# Altium schematic sheet Led_chaser2.SchDoc
size A4; SheetNumber: 1; SheetTotal: 1
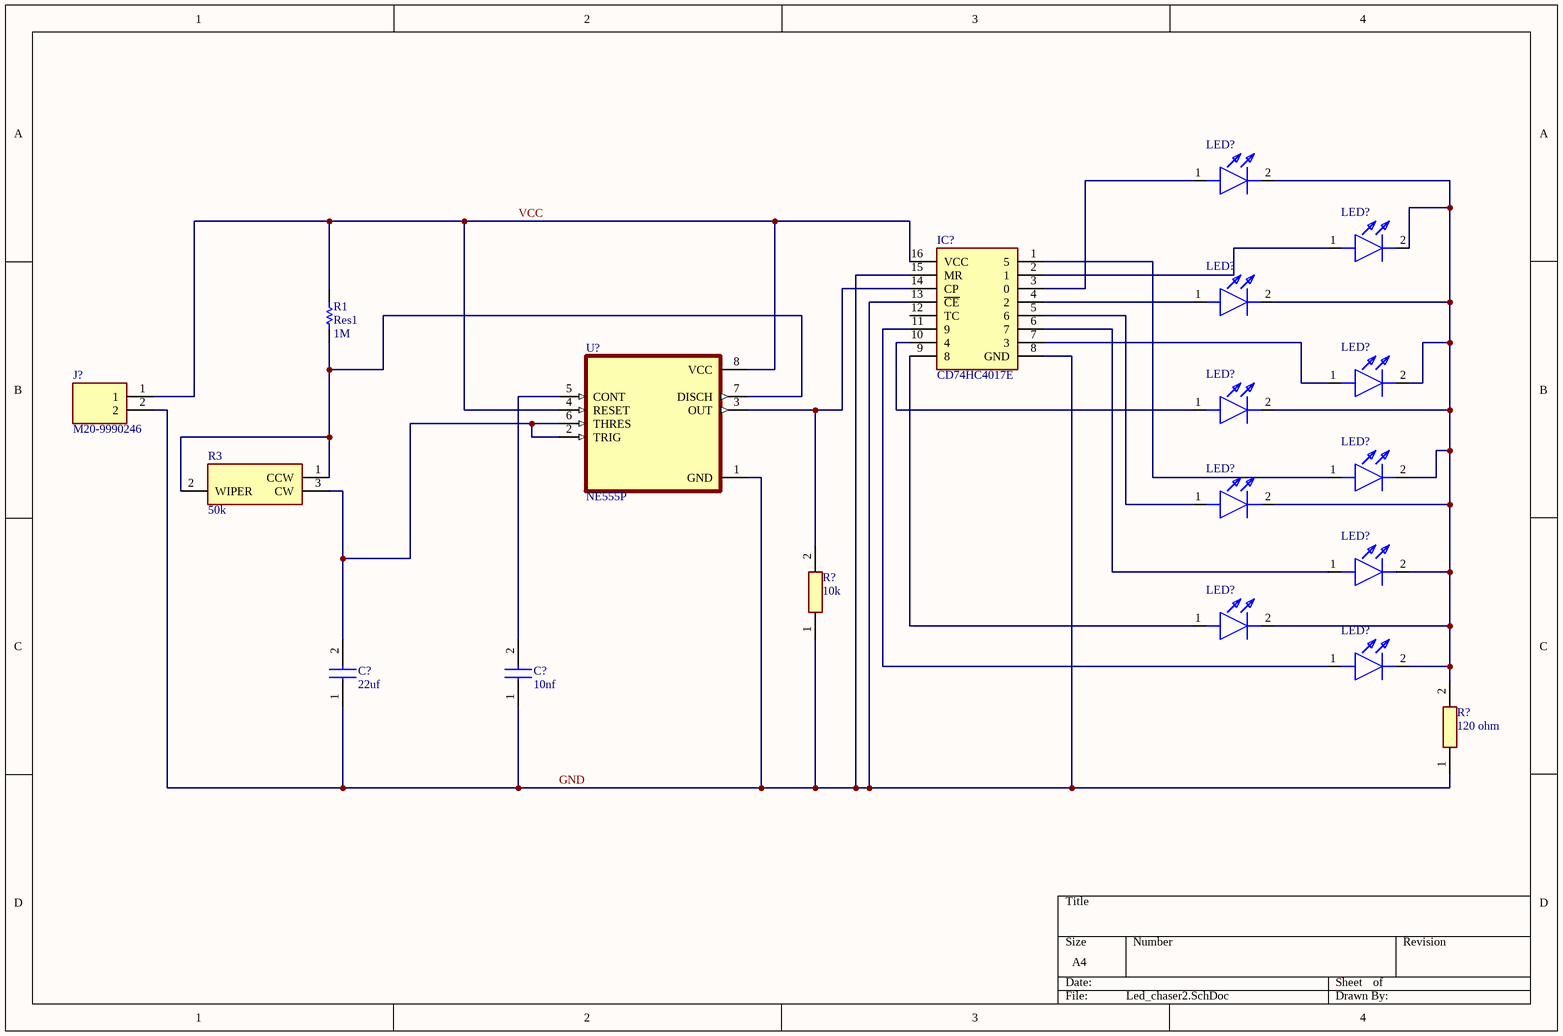
[diagram p0: Led_chaser2.SchDoc]

## Parts
(Parts that share a designator on the sheet are numbered #1, #2 ... from top to bottom, then left to right.)
C?#1  22uf  [RCEC71H226MWK1H03B]
C?#2  10nf  [RCEC71H226MWK1H03B]
IC?  CD74HC4017E  [DIP794W53P254L1930H508Q16N]
J?  M20-9990246  [HDRV2W66P0X254_1X2_508X254X874P]
LED?#1  151051BS04000  [151051BS04000]  (value not drawn)
LED?#2  151051BS04000  [151051BS04000]  (value not drawn)
LED?#3  151051BS04000  [151051BS04000]  (value not drawn)
LED?#4  151051BS04000  [151051BS04000]  (value not drawn)
LED?#5  151051BS04000  [151051BS04000]  (value not drawn)
LED?#6  151051BS04000  [151051BS04000]  (value not drawn)
LED?#7  151051BS04000  [151051BS04000]  (value not drawn)
LED?#8  151051BS04000  [151051BS04000]  (value not drawn)
LED?#9  151051BS04000  [151051BS04000]  (value not drawn)
LED?#10  151051BS04000  [151051BS04000]  (value not drawn)
R1  Res1  value 1M  [AXIAL-0.3]
R3  50k  [3386P_1]
R?#1  10k  [RESAD1700W60L700D250]
R?#2  120 ohm  [RESAD1700W60L700D250]
U?  NE555P  [DIP794W45P254L959H508Q8]

## Nets
GND: C?#1.1 C?#2.1 IC?.8(GND) IC?.13(~{CE}) IC?.15(MR) J?.2 R?#1.1 R?#2.1 U?.1(GND)
VCC: IC?.16(VCC) J?.1 R1.2 U?.4(RESET) U?.8(VCC)
NetC?#1_2: C?#1.2 R3.3(CW) U?.2(TRIG) U?.6(THRES)
NetC?#2_2: C?#2.2 U?.5(CONT)
NetIC?_1: IC?.1(5) LED?#6.1(A)
NetIC?_2: IC?.2(1) LED?#2.1(A)
NetIC?_3: IC?.3(0) LED?#1.1(A)
NetIC?_4: IC?.4(2) LED?#3.1(A)
NetIC?_5: IC?.5(6) LED?#7.1(A)
NetIC?_6: IC?.6(7) LED?#8.1(A)
NetIC?_7: IC?.7(3) LED?#4.1(A)
NetIC?_9: IC?.9(8) LED?#9.1(A)
NetIC?_10: IC?.10(4) LED?#5.1(A)
NetIC?_11: IC?.11(9) LED?#10.1(A)
NetIC?_14: IC?.14(CP) R?#1.2 U?.3(OUT)
NetLED?#1_2: LED?#1.2(K) LED?#2.2(K) LED?#3.2(K) LED?#4.2(K) LED?#5.2(K) LED?#6.2(K) LED?#7.2(K) LED?#8.2(K) LED?#9.2(K) LED?#10.2(K) R?#2.2
NetR1_1: R1.1 R3.1(CCW) R3.2(WIPER) U?.7(DISCH)

Not connected (* = marked no-connect by the designer): IC? 12(TC)

## Library data of the parts
C?#1 C?#2 = RCER71E226MWM1H03A: Capacitor; Manufacturer_Name: Murata Electronics; Datasheet Link: https://psearch.en.murata.com/capacitor/product/RCER71E226MWM1H03A.html; Height: 10mm; Manufacturer_Part_Number: RCER71E226MWM1H03A; Mouser Part Number: 81-RCER71E226MWM1H3A; Mouser Price/Stock: https://www.mouser.co.uk/ProductDetail/Murata-Electronics/RCER71E226MWM1H03A/?qs=Zt%252BKPUOg4ofMKWtzCSsNGA%3D%3D
IC? = CD74HC4017E: Integrated Circuit; Manufacturer_Name: Texas Instruments; Datasheet Link: http://www.ti.com/lit/gpn/cd74hc4017; Height: 5.08mm; Manufacturer_Part_Number: CD74HC4017E; Mouser Part Number: 595-CD74HC4017E; Mouser Price/Stock: https://www.mouser.co.uk/ProductDetail/Texas-Instruments/CD74HC4017E?qs=spW5eSrOWB5vviXLi8qByQ%3D%3D; Arrow Part Number: CD74HC4017E; Arrow Price/Stock: https://www.arrow.com/en/products/cd74hc4017e/texas-instruments?region=nac
J? = M20-9990246: Connector; Manufacturer_Name: Harwin; Datasheet Link: https://cdn.harwin.com/pdfs/M20-999.pdf; Height: 8.74mm; Manufacturer_Part_Number: M20-9990246; Mouser Part Number: 855-M20-9990246; Mouser Price/Stock: https://www.mouser.co.uk/ProductDetail/Harwin/M20-9990246?qs=Jph8NoUxIfWjw4WmyRvzag%3D%3D
LED?#1-LED?#10 = 151051BS04000: LED; Manufacturer_Name: Wurth Elektronik; Datasheet Link: https://katalog.we-online.de/led/datasheet/151051BS04000.pdf; Height: 8.95mm; Manufacturer_Part_Number: 151051BS04000; Mouser Part Number: 710-151051BS04000; Mouser Price/Stock: https://www.mouser.co.uk/ProductDetail/Wurth-Elektronik/151051BS04000?qs=LlUlMxKIyB3OjuZOlqaOjg%3D%3D
R1 = Res1: Resistor; Published: 8-Jun-2000; LatestRevisionDate: 17-Jul-2002; LatestRevisionNote: Re-released for DXP Platform.; PackageReference: AXIAL-0.3; Publisher: Altium Limited; PackageDescription: Axial Device, Thru-Hole; 2 Leads; 0.3 in Pin Spacing
R3 = 3386P-1-104LF: Variable Resistor; Manufacturer_Name: Bourns; Datasheet Link: https://componentsearchengine.com/Datasheets/2/3386P-1-104LF.pdf; Manufacturer_Part_Number: 3386P-1-104LF; Mouser Part Number: 652-3386P-1-104LF; Mouser Price/Stock: https://www.mouser.co.uk/ProductDetail/Bourns/3386P-1-104LF?qs=m2uG%2FFdTAPVt57WUqvIChw%3D%3D; Arrow Part Number: 3386P-1-104LF; Arrow Price/Stock: https://www.arrow.com/en/products/3386p-1-104lf/bourns?region=nac
R?#1 R?#2 = OD103JE: Resistor; Manufacturer_Name: Ohmite; Datasheet Link: https://componentsearchengine.com/Datasheets/2/OD103JE.pdf; Manufacturer_Part_Number: OD103JE; Mouser Part Number: 588-OD103JE; Mouser Price/Stock: https://www.mouser.co.uk/ProductDetail/Ohmite/OD103JE?qs=FhgLWrJuMt%252B%2F7VciYatGIg%3D%3D
U? = NE555P: Package: None; Price: None; Value: *; MP: NE555P; Availability: Unavailable